# Altium schematic sheet ArtFire_Status.SchDoc
size 177 x 127 mm
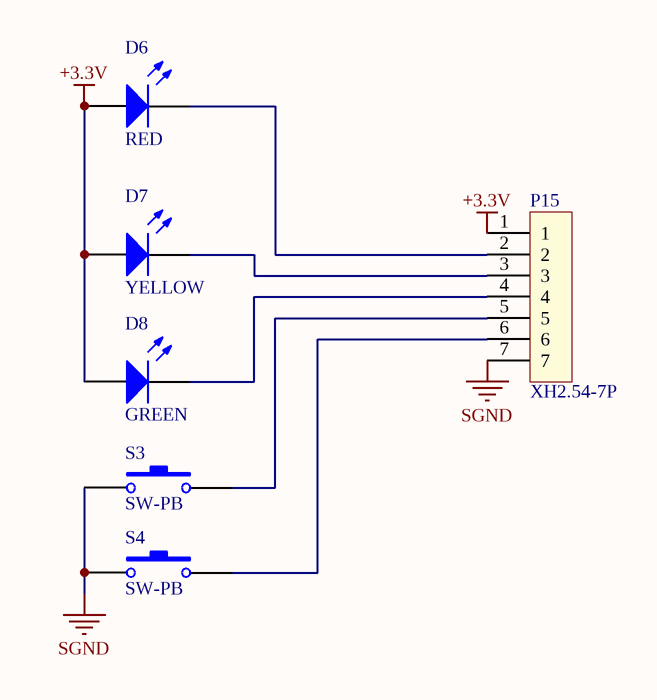
[diagram p0: ArtFire_Status.SchDoc]

## Parts
D6  RED  [LED-1]
D7  YELLOW  [LED-1]
D8  GREEN  [LED-1]
P15  XH2.54-7P  [XH2.54-7P]
S3  SW-PB  [KEY_B]
S4  SW-PB  [KEY_B]

## Nets
+3.3V: D6.1(A) D7.1(A) D8.1(A) P15.1
SGND: P15.7 S3.1 S4.1
NetD6_2: D6.2(K) P15.2
NetD7_2: D7.2(K) P15.3
NetD8_2: D8.2(K) P15.4
NetP15_5: P15.5 S3.2
NetP15_6: P15.6 S4.2

## Notes on the sheet
- Title
- Date
- Version
- XB Technology

## Library data of the parts
D6-D8 = LED1: Typical RED GaAs LED; Published: 8-Jun-2000; LatestRevisionDate: 08-Jul-2005; LatestRevisionNote: Mech Layer 1 removed.; PackageReference: LED-1; Publisher: Altium Limited; PackageDescription: LED; 2 Leads
S3 S4 = SW-PB: Switch; Published: 24-Mar-1999; LatestRevisionDate: 17-Jul-2002; LatestRevisionNote: Re-released for DXP Platform.; PackageReference: SPST-2; Publisher: Altium Limited; PackageDescription: Switch; 2 Leads